# Altium project ClockMatrix.PrjPcb
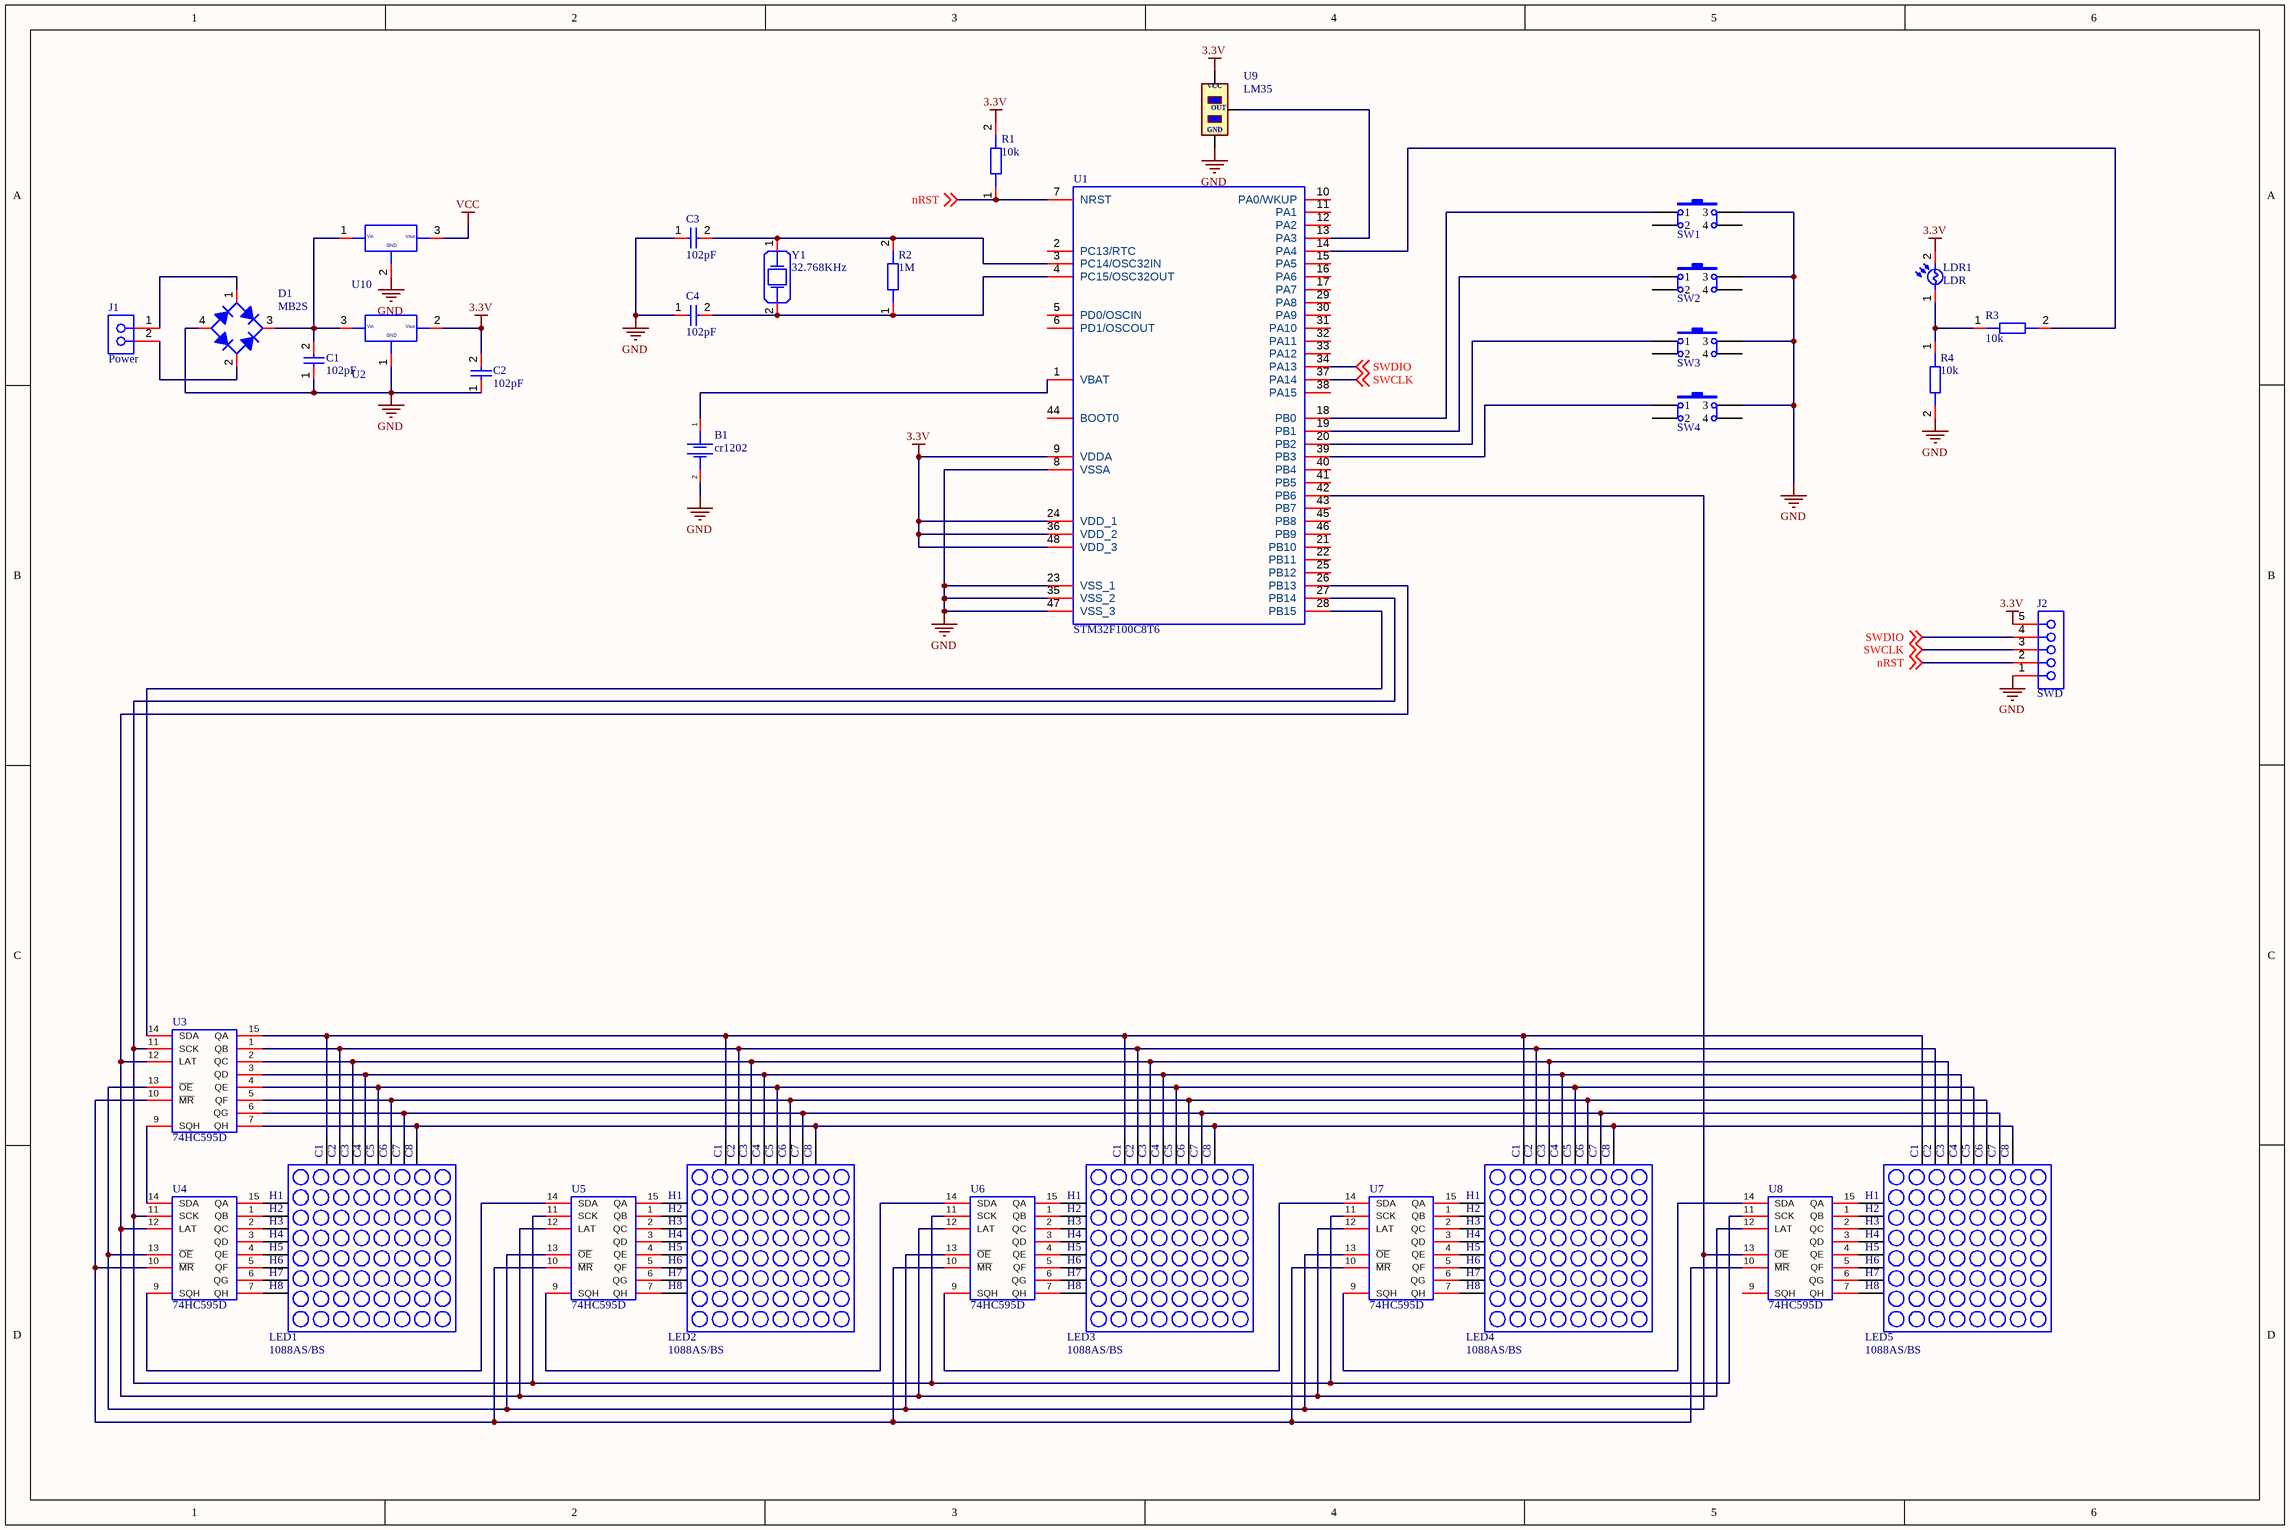
[diagram p0: Sheet1.SchDoc]
1 sheet, 33 parts. Net scope: global (net labels, ports and power ports of the same name join across sheets).
Board file: PCB1.PcbDoc

## Sheet Sheet1.SchDoc
size 449 x 299 mm

### Parts
B1  cr1202  [CR1220]
C1  102pF  [C0805]
C2  102pF  [C0805]
C3  102pF  [C0805]
C4  102pF  [C0805]
D1  MB2S  [TO-269AA]
J1  Power  [Header 2x1 TH Pitch 2.54mm]
J2  SWD  [Header 5x1 TH Pitch 2.54mm]
LDR1  LDR  [LDR_CELL_THRU_HOLE]
LED1  1088AS/BS  [LED_MATRIX_1088AS/BS]
LED2  1088AS/BS  [LED_MATRIX_1088AS/BS]
LED3  1088AS/BS  [LED_MATRIX_1088AS/BS]
LED4  1088AS/BS  [LED_MATRIX_1088AS/BS]
LED5  1088AS/BS  [LED_MATRIX_1088AS/BS]
R1  10k  [R0805]
R2  1M  [R0805]
R3  10k  [R0805]
R4  10k  [R0805]
SW1  Button1  [BUTTON_HOLE_5.0mm]  (value not drawn)
SW2  Button1  [BUTTON_HOLE_5.0mm]  (value not drawn)
SW3  Button1  [BUTTON_HOLE_5.0mm]  (value not drawn)
SW4  Button1  [BUTTON_HOLE_5.0mm]  (value not drawn)
U1  STM32F100C8T6  [LQFP048_FPT-48P-M05]
U2  AMS1117  [SOT223-3]  (value not drawn)
U3  74HC595D  [SO16]
U4  74HC595D  [SO16]
U5  74HC595D  [SO16]
U6  74HC595D  [SO16]
U7  74HC595D  [SO16]
U8  74HC595D  [SO16]
U9  LM35  [TO92A]
U10  LM7805  [TO252-3]  (value not drawn)
Y1  32.768KHz  [DT-26]

### Nets
3.3V: C2.2 J2.5 LDR1.2 R1.2 U1.9(VDDA) U1.24(VDD_1) U1.36(VDD_2) U1.48(VDD_3) U2.2 U9.1(VCC)
GND: B1.2 C1.1 C2.1 C3.1 C4.1 D1.4 J2.1 R4.2 SW1.3 SW2.3 SW3.3 SW4.3 U1.8(VSSA) U1.23(VSS_1) U1.35(VSS_2) U1.47(VSS_3) U2.1 U3.8 U4.8 U5.8 U6.8 U7.8 U8.8 U9.3(GND) U10.2
VCC: U3.16 U4.16 U5.16 U6.16 U7.16 U8.16 U10.3
nRST: J2.2 R1.1 U1.7(NRST) ; off-sheet nRST
SWCLK: J2.3 U1.37(PA14) ; off-sheet SWCLK
SWDIO: J2.4 U1.34(PA13) ; off-sheet SWDIO
NetB1_1: B1.1 U1.1(VBAT)
NetC1_2: C1.2 D1.3 U2.3 U10.1
NetC3_2: C3.2 R2.2 U1.3(PC14/OSC32IN) Y1.1
NetC4_2: C4.2 R2.1 U1.4(PC15/OSC32OUT) Y1.2
NetD1_1: D1.1 J1.1
NetD1_2: D1.2 J1.2
NetLDR1_1: LDR1.1 R3.1 R4.1
NetLED1_1: LED1.1 U4.4(QE)
NetLED1_2: LED1.2 U4.6(QG)
NetLED1_3: LED1.3 LED2.3 LED3.3 LED4.3 LED5.3 U3.1(QB)
NetLED1_4: LED1.4 LED2.4 LED3.4 LED4.4 LED5.4 U3.2(QC)
NetLED1_5: LED1.5 U4.7(QH)
NetLED1_6: LED1.6 LED2.6 LED3.6 LED4.6 LED5.6 U3.4(QE)
NetLED1_7: LED1.7 U4.5(QF)
NetLED1_8: LED1.8 U4.2(QC)
NetLED1_9: LED1.9 U4.15(QA)
NetLED1_10: LED1.10 LED2.10 LED3.10 LED4.10 LED5.10 U3.3(QD)
NetLED1_11: LED1.11 LED2.11 LED3.11 LED4.11 LED5.11 U3.5(QF)
NetLED1_12: LED1.12 U4.3(QD)
NetLED1_13: LED1.13 LED2.13 LED3.13 LED4.13 LED5.13 U3.15(QA)
NetLED1_14: LED1.14 U4.1(QB)
NetLED1_15: LED1.15 LED2.15 LED3.15 LED4.15 LED5.15 U3.6(QG)
NetLED1_16: LED1.16 LED2.16 LED3.16 LED4.16 LED5.16 U3.7(QH)
NetLED2_1: LED2.1 U5.4(QE)
NetLED2_2: LED2.2 U5.6(QG)
NetLED2_5: LED2.5 U5.7(QH)
NetLED2_7: LED2.7 U5.5(QF)
NetLED2_8: LED2.8 U5.2(QC)
NetLED2_9: LED2.9 U5.15(QA)
NetLED2_12: LED2.12 U5.3(QD)
NetLED2_14: LED2.14 U5.1(QB)
NetLED3_1: LED3.1 U6.4(QE)
NetLED3_2: LED3.2 U6.6(QG)
NetLED3_5: LED3.5 U6.7(QH)
NetLED3_7: LED3.7 U6.5(QF)
NetLED3_8: LED3.8 U6.2(QC)
NetLED3_9: LED3.9 U6.15(QA)
NetLED3_12: LED3.12 U6.3(QD)
NetLED3_14: LED3.14 U6.1(QB)
NetLED4_1: LED4.1 U7.4(QE)
NetLED4_2: LED4.2 U7.6(QG)
NetLED4_5: LED4.5 U7.7(QH)
NetLED4_7: LED4.7 U7.5(QF)
NetLED4_8: LED4.8 U7.2(QC)
NetLED4_9: LED4.9 U7.15(QA)
NetLED4_12: LED4.12 U7.3(QD)
NetLED4_14: LED4.14 U7.1(QB)
NetLED5_1: LED5.1 U8.4(QE)
NetLED5_2: LED5.2 U8.6(QG)
NetLED5_5: LED5.5 U8.7(QH)
NetLED5_7: LED5.7 U8.5(QF)
NetLED5_8: LED5.8 U8.2(QC)
NetLED5_9: LED5.9 U8.15(QA)
NetLED5_12: LED5.12 U8.3(QD)
NetLED5_14: LED5.14 U8.1(QB)
NetR3_2: R3.2 U1.14(PA4)
NetSW1_1: SW1.1 U1.18(PB0)
NetSW2_1: SW2.1 U1.19(PB1)
NetSW3_1: SW3.1 U1.20(PB2)
NetSW4_1: SW4.1 U1.39(PB3)
NetU1_13: U1.13(PA3) U9.2(OUT)
NetU1_26: U1.26(PB13) U3.12(LAT) U4.12(LAT) U5.12(LAT) U6.12(LAT) U7.12(LAT) U8.12(LAT)
NetU1_27: U1.27(PB14) U3.11(SCK) U4.11(SCK) U5.11(SCK) U6.11(SCK) U7.11(SCK) U8.11(SCK)
NetU1_28: U1.28(PB15) U3.14(SDA)
NetU1_42: U1.42(PB6) U3.13(~{OE}) U4.13(~{OE}) U5.13(~{OE}) U6.13(~{OE}) U7.13(~{OE}) U8.13(~{OE})
NetU3_9: U3.9(SQH) U4.14(SDA)
NetU3_10: U3.10(~{MR}) U4.10(~{MR}) U5.10(~{MR}) U6.10(~{MR}) U7.10(~{MR}) U8.10(~{MR})
NetU4_9: U4.9(SQH) U5.14(SDA)
NetU5_9: U5.9(SQH) U6.14(SDA)
NetU6_9: U6.9(SQH) U7.14(SDA)
NetU7_9: U7.9(SQH) U8.14(SDA)

Not connected (* = marked no-connect by the designer): SW1 2 4; SW2 2 4; SW3 2 4; SW4 2 4; U1 2(PC13/RTC) 5(PD0/OSCIN) 6(PD1/OSCOUT) 10(PA0/WKUP) 11(PA1) 12(PA2) 15(PA5) 16(PA6) 17(PA7) 21(PB10) 22(PB11) 25(PB12) 29(PA8) 30(PA9) 31(PA10) 32(PA11) 33(PA12) 38(PA15) 40(PB4) 41(PB5) 43(PB7) 44(BOOT0) 45(PB8) 46(PB9); U8 9(SQH)

### Notes on the sheet
- (in symbol AMS1117(SOT-223)) Vin; Vout; GND
- (in symbol LED_MATRIX_1088AS/BS) C1; C2; C3; C4; C5; C6; C7; C8; H1; H2; H3; H4; H5; H6; H7; H8
- (in symbol LM7805) Vin; Vout; GND

### Library data of the parts
B1 = Batery
C1-C4 = Capacitors(SMD)
D1 = Diode MB2S
J1 = Header 2x1 TH Pitch 2.54mm
J2 = Header 5x1 TH Pitch 2.54mm
LED1-LED5 = LED_MATRIX_1088AS/BS
R1-R4 = Resistor SMD
U2 = AMS1117(SOT-223)
Y1 = Crystal 32.768KHz